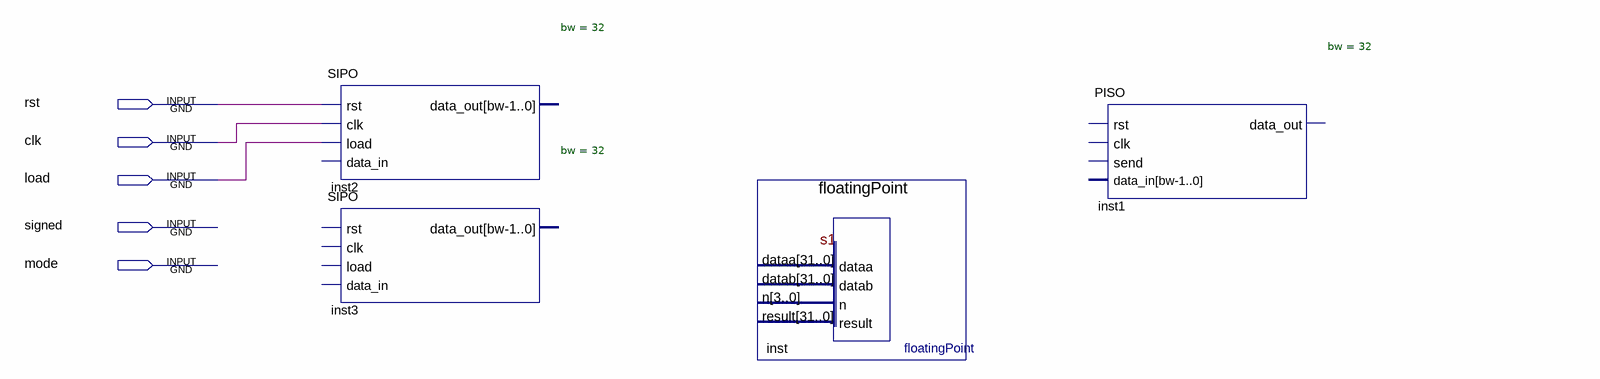
[diagram p0: schematic sheet]
// Quartus schematic TOP.bdf as structural Verilog: 4 symbols, 5 pins
module TOP (
  input  rst,
  input  clk,
  input  load,
  input  \signed ,
  input  mode
);

  SIPO #(.bw(32)) inst2 (.rst(rst), .clk(clk), .load(load));  // open: data_in, data_out
  SIPO #(.bw(32)) inst3 ();  // open: rst, clk, load, data_in, data_out
  floatingPoint inst ();  // open: dataa, datab, n, result
  PISO #(.bw(32)) inst1 ();  // open: rst, clk, send, data_in, data_out
endmodule
